# Altium schematic sheet IC555_FLOW_RELAY_MOTTOR.SchDoc
size A2; SheetNumber: 1; SheetTotal: 1
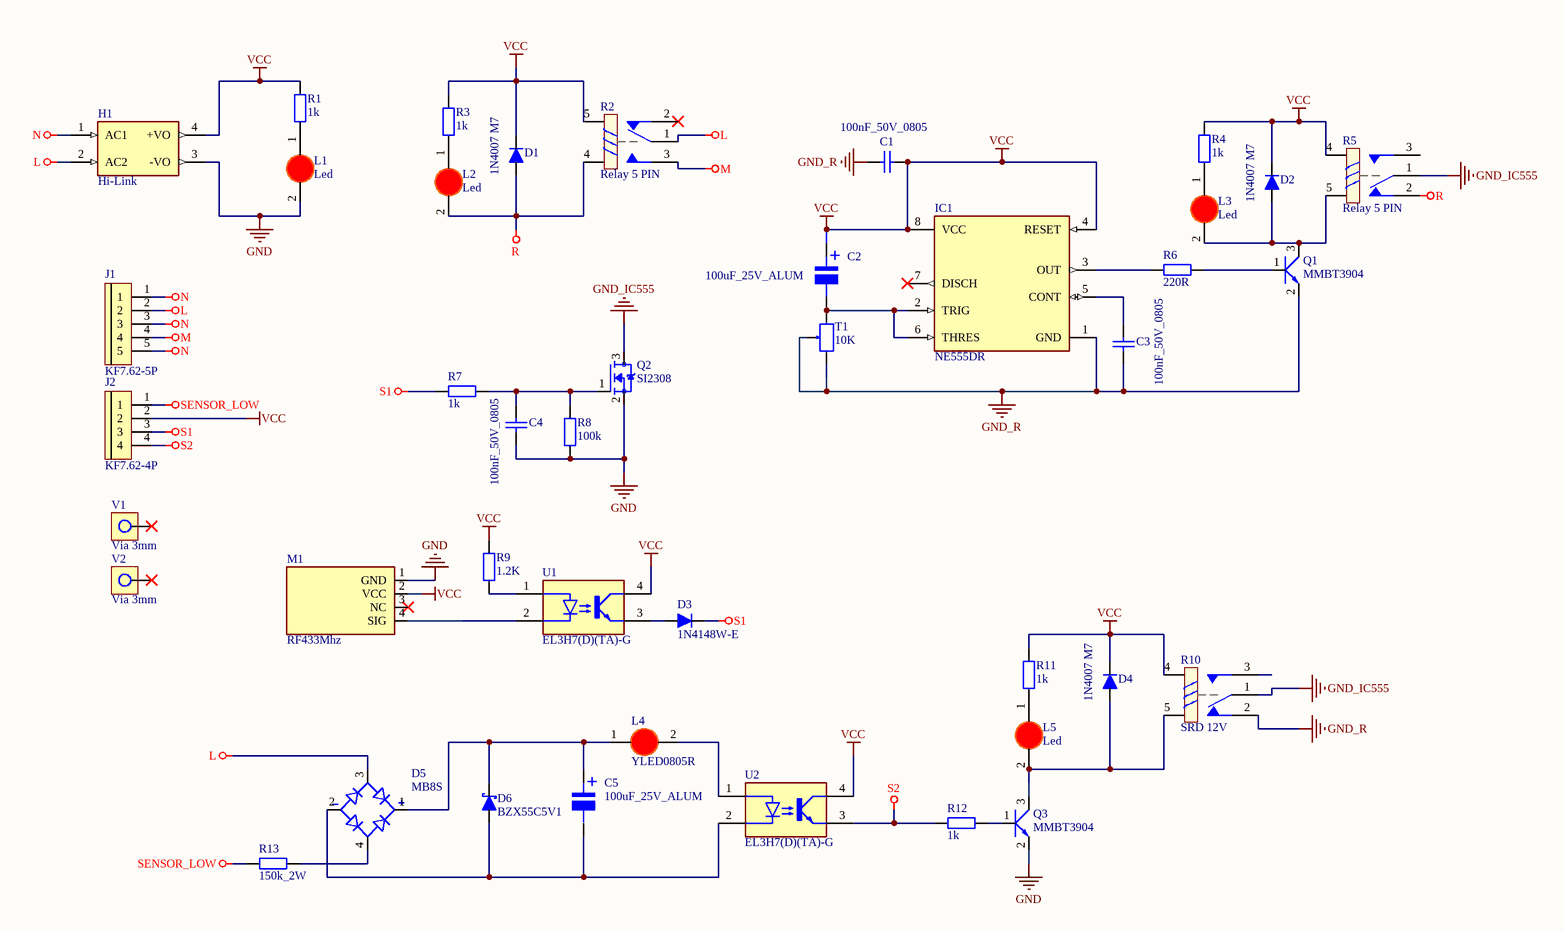
[diagram p0: IC555_FLOW_RELAY_MOTTOR.SchDoc]

## Parts
C1  100nF_50V_0805  [Capitor 0805]
C2  100uF_25V_ALUM  [CAPITOR D6.3 x L7.7mm (D)]
C3  100nF_50V_0805  [Capitor 0805]
C4  100nF_50V_0805  [Capitor 0805]
C5  100uF_25V_ALUM  [tu nhom 6.3 (d)]
D1  1N4007 M7  [DO-214AC]
D2  1N4007 M7  [DO-214AC]
D3  1N4148W-E  [SOD123]
D4  1N4007 M7  [DO-214AC]
D5  MB8S  [SOIC4W]
D6  BZX55C5V1  [DO-35]
H1  Hi-Link  [HI-LINK 3W]
IC1  NE555DR  [8-SOIC]
J1  KF7.62-5P  [KF7.62 5P]
J2  KF7.62-4P  [KF7.62 4P]
L1  Led  [0805]
L2  Led  [0805]
L3  Led  [0805]
L4  YLED0805R  [YLED0805R]
L5  Led  [0805]
M1  RF433Mhz  [RF433Mhz 1CH]
Q1  MMBT3904  [SOT-23]
Q2  SI2308  [SOT-23]
Q3  MMBT3904  [SOT-23]
R1  1k  [Resistor 0805]
R2  Relay 5 PIN  [RELAY YL224-A-S 5PIN]
R3  1k  [Resistor 0805]
R4  1k  [Resistor 0805]
R5  Relay 5 PIN  [Relay SRD 5 PIN]
R6  220R  [Resistor 0805]
R7  1k  [Resistor 0805]
R8  100k  [Resistor 0805]
R9  1.2K  [Resistor 0805]
R10  SRD 12V  [Relay SRD 5 PIN]
R11  1k  [Resistor 0805]
R12  1k  [Resistor 0805]
R13  150k_2W  [Resistor DIP 2W TYPE1]
T1  10K  [Bien Tro Vi Chinh Dung]
U1  EL3H7(D)(TA)-G  [4-SSOP]
U2  EL3H7(D)(TA)-G  [4-SSOP]
V1  Via 3mm  [Via 3mm]
V2  Via 3mm  [Via 3mm]

## Nets
GND: C4.1 H1.3(-VO) L1.2(K) M1.1(GND) Q2.2(S) Q3.2(E) R8.1
GND_IC555: Q2.3(D) R5.1 R10.1
GND_R: C1.2 C3.2 IC1.1(GND) Q1.2(E) R10.2 T1.2 T1.3
L: D5.3(AC1) H1.2(AC2) J1.2 R2.1
M: J1.4 R2.3
N: H1.1(AC1) J1.1 J1.3 J1.5
R: D1.A L2.2(K) R2.4 R5.2
S1: D3.C(K) J2.3 R7.1
S2: J2.4 R12.1 U2.3(E)
SENSOR_LOW: J2.1 R13.1
VCC: C1.1 C2.1 D1.C(K) D2.C(K) D4.C(K) H1.4(+VO) IC1.4(RESET) IC1.8(VCC) J2.2 M1.2(VCC) R1.1 R2.5 R3.1 R4.1 R5.4 R9.1 R10.4 R11.1 U1.4(CO) U2.4(CO)
NetC2_2: C2.2 IC1.2(TRIG) IC1.6(THRES) T1.1
NetC3_1: C3.1 IC1.5(CONT)
NetC4_2: C4.2 Q2.1(G) R7.2 R8.2
NetC5_1: C5.1 D5.1(POS) D6.C(K) L4.1(A)
NetC5_2: C5.2 D5.2(NEG) D6.A U2.2(C)
NetD2_A: D2.A L3.2(K) Q1.3(C) R5.5
NetD3_A: D3.A U1.3(E)
NetD4_A: D4.A L5.2(K) Q3.3(C) R10.5
NetD5_4: D5.4(AC2) R13.2
NetIC1_3: IC1.3(OUT) R6.1
NetL1_1: L1.1(A) R1.2
NetL2_1: L2.1(A) R3.2
NetL3_1: L3.1(A) R4.2
NetL4_2: L4.2(K) U2.1(A)
NetL5_1: L5.1(A) R11.2
NetM1_4: M1.4(SIG) U1.2(C)
NetQ1_1: Q1.1(B) R6.2
NetQ3_1: Q3.1(B) R12.2
NetR9_2: R9.2 U1.1(A)

Not connected (* = marked no-connect by the designer): IC1 7(DISCH)*; M1 3(NC)*; R2 2*; R5 3; R10 3; V1 1*; V2 1*

## Notes on the sheet
- (in symbol 100uF_25V_ALUM) +
- (in symbol Tu Nhom 100uF 25V) +

## Library data of the parts
C1 C3 C4 = 100nF_50V_0805: Manufacturer: YAGEO; Part Number: CC0805KRX7R9BB104; Package & Pin: 0805___2; Product Link: https://www.lcsc.com/product-detail/C49678.html?s_z=n_CC0805KRX7R9BB104
C2 = 100uF_25V_ALUM: SMD; Manufacturer: KNSCHA; Part Number: RVT100UF25V67RV0011; Package & Pin: SMD,D6.3xL7.7mm___2; Product Link: https://www.lcsc.com/product-detail/C2836443.html?s_z=n_RVT100Uf
C5 = Tu Nhom 100uF 25V: Dán; Don_Vi: Con; So_Chan: 2; Ten_Linh_Kien: Tụ Nhôm 100uF 25V 6x7MM; Ma_Hang: MH002222; Chung_Loai: Dán; Kieu_Chan: *
D1 D2 D4 = 1N4007 M7: Manufacturer: JSMSEMI; Package & Pin: SMA___2; Part Number: 1N4007 M7; Product Link: https://www.lcsc.com/product-detail/C20754788.html?s_z=n_M7
D3 = 1N4148W-E: Manufacturer: MDD; Package & Pin: SOD-123___2; Part Number: 1N4148W-E; Product Link: https://www.lcsc.com/product-detail/C41371420.html?s_z=n_1N4148
D5 = MB8S: 800V 0.5A; Manufacturer: onsemi; Package & Pin: SOIC-4___4; Part Number: MB8S; Product Link: https://www.lcsc.com/product-detail/C232761.html?s_z=n_MB8S
D6 = BZX55C5V1: 5.1VDC 0.5W; Manufacturer: LGE; Package & Pin: DO-35___2; Part Number: BZX55C5V1; Product Link: https://www.lcsc.com/product-detail/C5158979.html?s_z=n_BZX55C5V1
J1 = KF7.62-5P: Manufacturer: Cixi Kefa Elec; Package & Pin: DIP___5; Part Number: KF7.62-5P; Product Link: https://www.thegioiic.com/kf7-62-5-terminal-khoi-han-pcb-5-cuc-20a-300v-7-62mm
J2 = KF7.62-4P: Manufacturer: Cixi Kefa Elec; Package & Pin: DIP___4; Part Number: KF7.62-4P; Product Link: https://www.lcsc.com/product-detail/C707826.html?s_z=n_Cixi%2520Kefa%2520Elec%2520KF7.62-4P
L4 = YLED0805R: Manufacturer: YONGYUTAI; Package & Pin: 0805___2; Part Number: YLED0805R; Product Link: https://www.lcsc.com/product-detail/C19171391.html?s_z=n_YLED0805R
M1 = RF433Mhz: 1CH; Manufacturer: ?; Package & Pin: ?; Part Number: ?; Product Link: https://shopee.vn/product/971796452/22335540315?d_id=76a2c&uls_trackid=549fr85v01bg&utm_content=342dNobdyiYz4JGNN4699fwjtUFq
Q1 Q3 = 2SC1815: Manufacturer: GOODWORK; Package & Pin: SOT-23___3; Part Number: 2SC1815; Product Link: https://www.lcsc.com/product-detail/C909752.html?s_z=n_1815
Q2 = SI2308: Manufacturer: HXY MOSFET; Package & Pin: SOT-23___3; Part Number: SI2308; Product Link: https://www.lcsc.com/product-detail/C5337194.html?s_z=n_China%2520SI2308
R1 R3 R4 R6-R9 R11 R12 = Res
R10 = Relay 5 PIN: Manufacturer: ?; Package & Pin: ?; Part Number: ?; Product Link: ?
R13 = 150k_2W: Manufacturer: CCO(Chian Chia Elec); Part Number: MOF2WS-150KΩ±5% T; Package & Pin: Through Hole,D4.5xL11.5mm___2; Product Link: https://www.lcsc.com/product-detail/C121715.html?s_z=n_2W-150K%25CE%25A9
T1 = Bien Tro Tinh Chinh 10K Dung: Cắm; Ma_Hang: MH003232; Ten_Linh_Kien: Biến Trở VR 103-10K 3296W; Don_Vi: Con; Kieu_Chan: *; Chung_Loai: Cắm; Ghi_Chu: *
U1 U2 = EL3H7(D)(TA)-G: Manufacturer: EVERLIGHT; Package & Pin: SOIC-4-175mil___4; Part Number: EL3H7(D)(TA)-G; Product Link: https://www.lcsc.com/product-detail/C142287.html
R2 R5 = Relay 5 PIN: Manufacturer: ?; Package & Pin: ?; Part Number: ?; Product Link: ?